# Altium project PCB_PatternDesignReference.PrjPcb
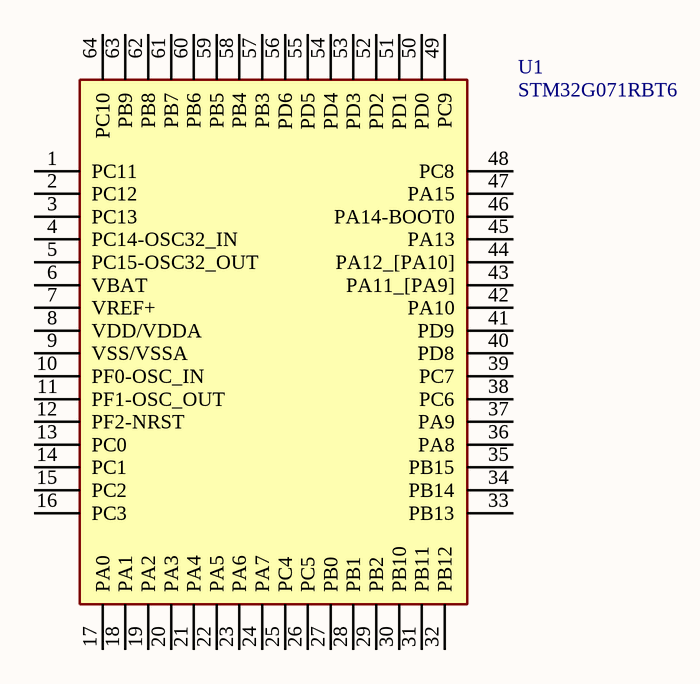
[diagram p0: PCB_PatternDesignReference.SchDoc]
1 sheet, 1 parts. Net scope: global (net labels, ports and power ports of the same name join across sheets).
Board file: PCB_PatternDesignReference.PcbDoc

## Sheet PCB_PatternDesignReference.SchDoc
size A4; SheetNumber: 1; SheetTotal: 1

### Parts
U1  STM32G071RBT6  [QFP50P1200X1200X160-64N]

### Nets

Not connected (* = marked no-connect by the designer): U1 1(PC11) 2(PC12) 3(PC13) 4(PC14-OSC32_IN) 5(PC15-OSC32_OUT) 6(VBAT) 7(VREF+) 8(VDD/VDDA) 9(VSS/VSSA) 10(PF0-OSC_IN) 11(PF1-OSC_OUT) 12(PF2-NRST) 13(PC0) 14(PC1) 15(PC2) 16(PC3) 17(PA0) 18(PA1) 19(PA2) 20(PA3) 21(PA4) 22(PA5) 23(PA6) 24(PA7) 25(PC4) 26(PC5) 27(PB0) 28(PB1) 29(PB2) 30(PB10) 31(PB11) 32(PB12) 33(PB13) 34(PB14) 35(PB15) 36(PA8) 37(PA9) 38(PC6) 39(PC7) 40(PD8) 41(PD9) 42(PA10) 43(PA11_[PA9]) 44(PA12_[PA10]) 45(PA13) 46(PA14-BOOT0) 47(PA15) 48(PC8) 49(PC9) 50(PD0) 51(PD1) 52(PD2) 53(PD3) 54(PD4) 55(PD5) 56(PD6) 57(PB3) 58(PB4) 59(PB5) 60(PB6) 61(PB7) 62(PB8) 63(PB9) 64(PC10)

### Library data of the parts
U1 = STM32G071RBT6: Integrated Circuit; Manufacturer_Name: STMicroelectronics; Datasheet Link: https://www.st.com/resource/en/datasheet/stm32g071rb.pdf; Height: 1.6mm; Manufacturer_Part_Number: STM32G071RBT6; Mouser Part Number: 511-STM32G071RBT6; Mouser Price/Stock: https://www.mouser.co.uk/ProductDetail/STMicroelectronics/STM32G071RBT6?qs=PqoDHHvF648HnzmnrdeU1A%3D%3D; Arrow Part Number: STM32G071RBT6; Arrow Price/Stock: https://www.arrow.com/en/products/stm32g071rbt6/stmicroelectronics